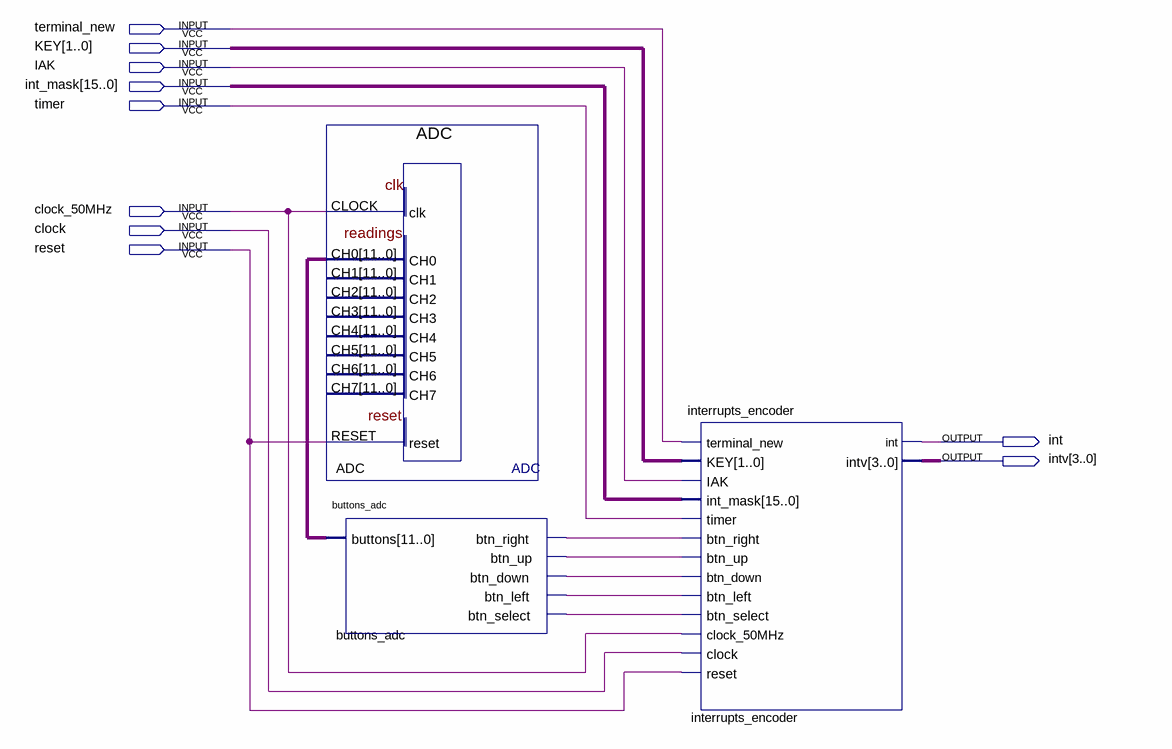
[diagram p0: schematic sheet]
// Quartus schematic interrupt_generator.bdf as structural Verilog: 3 symbols, 10 pins
module interrupt_generator (
  input  terminal_new,
  input  [1:0] KEY,
  input  IAK,
  input  [15:0] int_mask,
  input  timer,
  input  clock_50MHz,
  input  clock,
  input  reset,
  output \int ,
  output [3:0] intv
);

  wire buttons_adc_btn_down, buttons_adc_btn_left, buttons_adc_btn_right, buttons_adc_btn_select,
       buttons_adc_btn_up;
  wire [11:0] ADC_ch0;

  ADC ADC (.CLOCK(clock_50MHz), .RESET(reset), .CH0(ADC_ch0));  // open: CH1, CH2, CH3, CH4, CH5, CH6, CH7
  buttons_adc buttons_adc (
    .buttons(ADC_ch0), .btn_right(buttons_adc_btn_right), .btn_up(buttons_adc_btn_up),
    .btn_down(buttons_adc_btn_down), .btn_left(buttons_adc_btn_left), .btn_select(buttons_adc_btn_select));
  interrupts_encoder interrupts_encoder (
    .terminal_new(terminal_new), .KEY(KEY), .IAK(IAK), .int_mask(int_mask), .timer(timer),
    .btn_right(buttons_adc_btn_right), .btn_up(buttons_adc_btn_up), .btn_down(buttons_adc_btn_down),
    .btn_left(buttons_adc_btn_left), .btn_select(buttons_adc_btn_select), .clock_50MHz(clock_50MHz),
    .clock(clock), .reset(reset), .\int (\int ), .intv(intv));
endmodule
